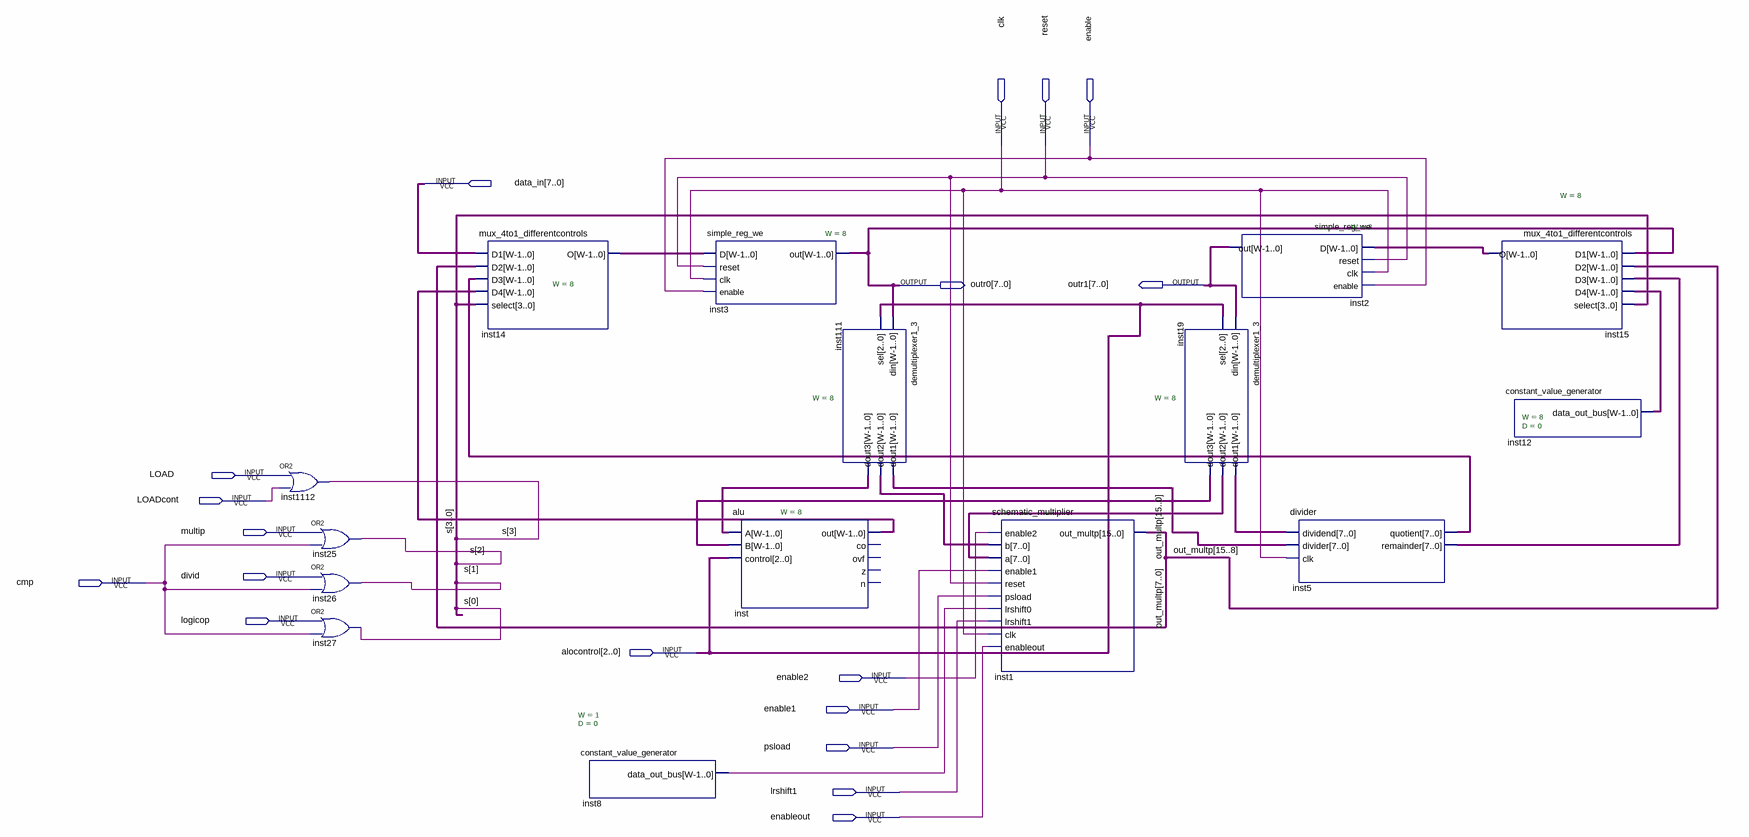
[diagram p0: schematic sheet]
// Quartus schematic alpv1.bdf as structural Verilog: 15 symbols, 18 pins
module alpv1 (
  input  clk,
  input  reset,
  input  enable,
  input  [7:0] data_in,
  input  LOAD,
  input  LOADcont,
  input  multip,
  input  divid,
  input  cmp,
  input  logicop,
  input  [2:0] alocontrol,
  input  enable2,
  input  enable1,
  input  psload,
  input  lrshift1,
  input  enableout,
  output [7:0] outr0,
  output [7:0] outr1
);

  wire inst8_data_out_bus;
  wire [3:0] s;
  wire [7:0] inst5_quotient, inst5_remainder, inst12_data_out_bus, inst14_o, inst15_o, inst19_dout1,
       inst19_dout2, inst19_dout3, inst111_dout1, inst111_dout2, inst111_dout3, inst_out;
  wire [15:0] out_multp;

  or inst1112 (s[3], LOAD, LOADcont);
  or inst25 (s[2], multip, cmp);
  or inst26 (s[1], divid, cmp);
  or inst27 (s[0], logicop, cmp);
  mux_4to1_differentcontrols #(.W(8)) inst14 (
    .D1(data_in), .D2(out_multp[7:0]), .D3(inst5_quotient), .D4(inst_out), .select(s), .O(inst14_o));
  constant_value_generator #(.W(1), .D(0)) inst8 (.data_out_bus(inst8_data_out_bus));
  simple_reg_we #(.W(8)) inst3 (.D(inst14_o), .reset(reset), .clk(clk), .enable(enable), .out(outr0));
  alu #(.W(8)) inst (.A(inst111_dout3), .B(inst19_dout3), .control(alocontrol), .out(inst_out));  // open: co, ovf, z, n
  demultiplexer1_3 #(.W(8)) inst111 (
    .din(outr0), .sel(alocontrol), .dout1(inst111_dout1), .dout2(inst111_dout2), .dout3(inst111_dout3));
  schematic_multiplier inst1 (
    .enable2(enable2), .b(inst111_dout2), .a(inst19_dout2), .enable1(enable1), .reset(reset),
    .psload(psload), .lrshift0(inst8_data_out_bus), .lrshift1(lrshift1), .clk(clk), .enableout(enableout),
    .out_multp(out_multp));
  demultiplexer1_3 #(.W(8)) inst19 (
    .din(outr1), .sel(alocontrol), .dout1(inst19_dout1), .dout2(inst19_dout2), .dout3(inst19_dout3));
  simple_reg_we #(.W(8)) inst2 (.D(inst15_o), .reset(reset), .clk(clk), .enable(enable), .out(outr1));
  divider inst5 (
    .dividend(inst19_dout1), .divider(inst111_dout1), .clk(clk), .quotient(inst5_quotient),
    .remainder(inst5_remainder));
  mux_4to1_differentcontrols #(.W(8)) inst15 (
    .D1(outr0), .D2(out_multp[15:8]), .D3(inst5_remainder), .D4(inst12_data_out_bus), .select(s), .O(inst15_o));
  constant_value_generator #(.W(8), .D(0)) inst12 (.data_out_bus(inst12_data_out_bus));
endmodule
